# Altium schematic sheet Sheet2.SchDoc
size 420 x 297 mm; DocumentNumber: АЕСН.464431.002Э3; SheetNumber: 2; SheetTotal: x; DocumentName: Sheet1.SCHDOC
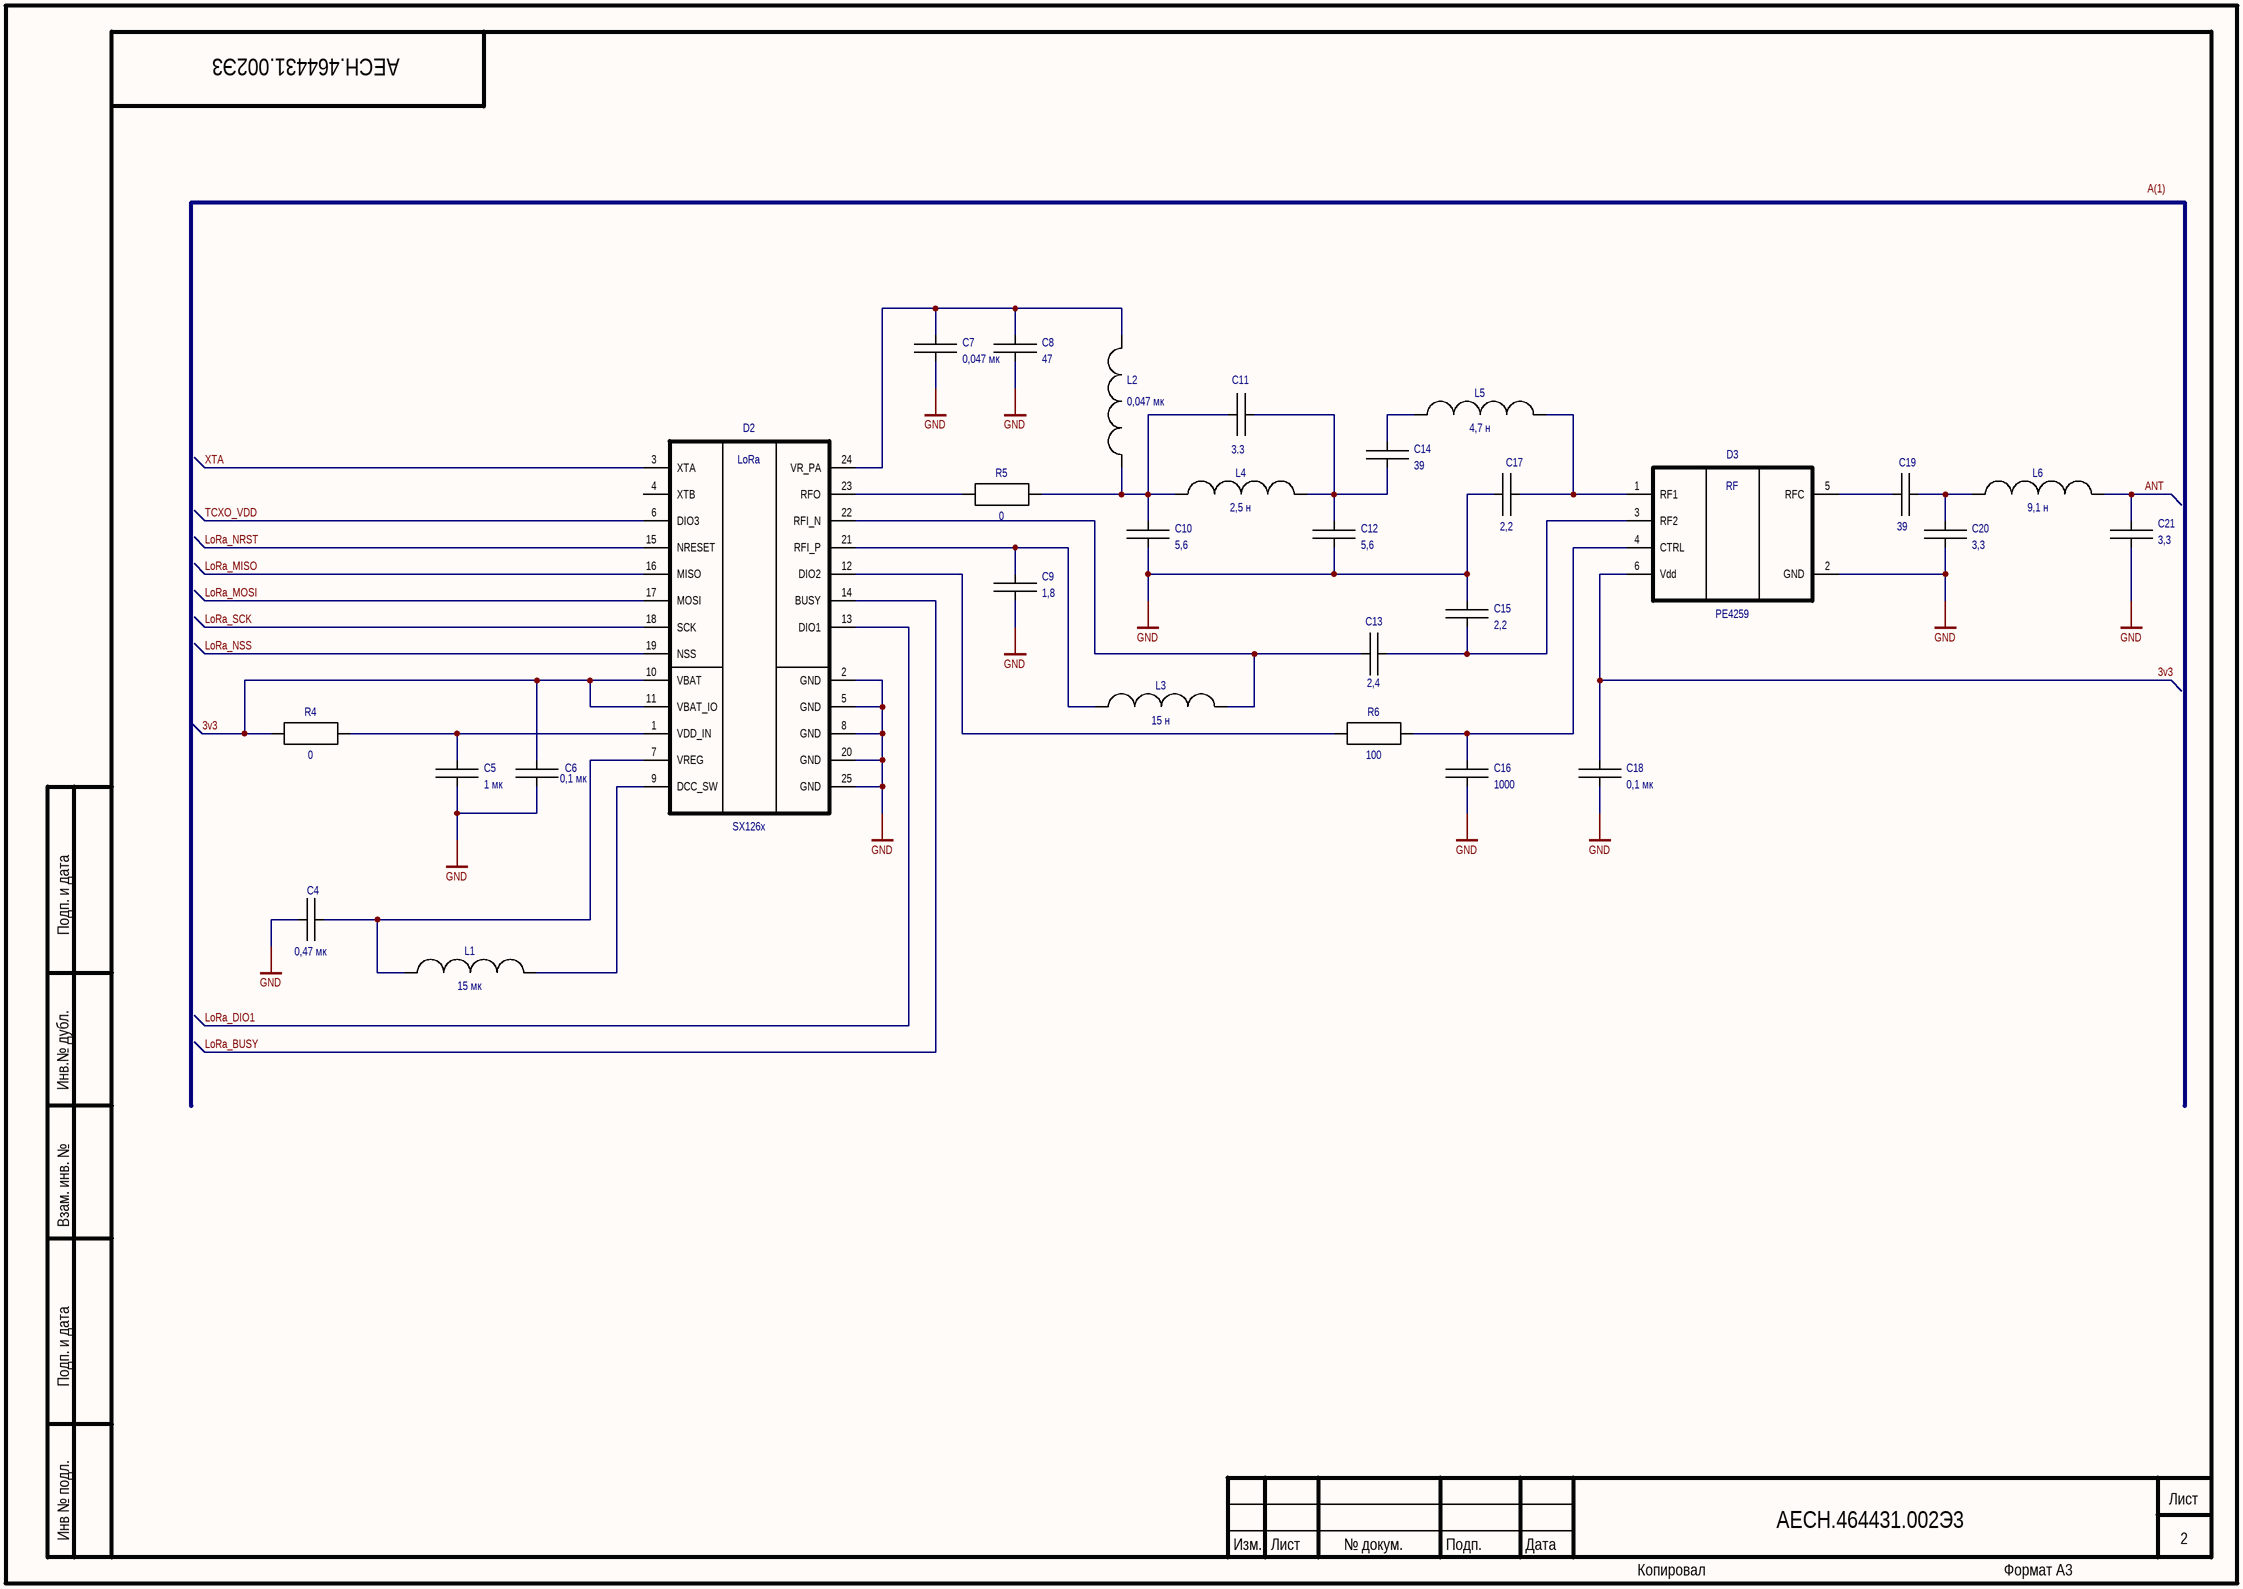
[diagram p0: Sheet2.SchDoc]

## Parts
C4  value 0,47 мк  [С0603]  (hidden comment: C)
C5  value 1 мк  [С0603]  (hidden comment: C)
C6  value 0,1 мк  [С0603]  (hidden comment: C)
C7  value 0,047 мк  [С0603]  (hidden comment: C)
C8  value 47  [С0603]  (hidden comment: C)
C9  value 1,8  [С0603]  (hidden comment: C)
C10  value 5,6  [С0603]  (hidden comment: C)
C11  value 3.3  [С0603]  (hidden comment: C)
C12  value 5,6  [С0603]  (hidden comment: C)
C13  value 2,4  [С0603]  (hidden comment: C)
C14  value 39  [С0603]  (hidden comment: C)
C15  value 2,2  [С0603]  (hidden comment: C)
C16  value 1000  [С0603]  (hidden comment: C)
C17  value 2,2  [С0603]  (hidden comment: C)
C18  value 0,1 мк  [С0603]  (hidden comment: C)
C19  value 39  [С0603]  (hidden comment: C)
C20  value 3,3  [С0603]  (hidden comment: C)
C21  value 3,3  [С0603]  (hidden comment: C)
D2  SX126x  [QFN24_4X4_SEM]
D3  PE4259  [SC70-6]
L1  value 15 мк  [IND_0805]  (hidden comment: L)
L2  value 0,047 мк  [INDC_0603]  (hidden comment: L)
L3  value 15 н  [INDC_0603]  (hidden comment: L)
L4  value 2,5 н  [INDC_0603]  (hidden comment: L)
L5  value 4,7 н  [INDC_0603]  (hidden comment: L)
L6  value 9,1 н  [INDC_0603]  (hidden comment: L)
R4  value 0  [R0603]  (hidden comment: R)
R5  value 0  [R0603]  (hidden comment: R)
R6  value 100  [R0603]  (hidden comment: R)

## Nets
GND: C4.1 C5.2 C6.2 C7.2 C8.2 C9.2 C10.2 C12.2 C15.1 C16.2 C17.1 C18.2 C20.2 C21.2 D2.2(GND) D2.5(GND) D2.8(GND) D2.20(GND) D2.25(GND) D3.2(GND)
3v3: C6.1 C18.1 D2.10(VBAT) D2.11(VBAT_IO) D3.6(Vdd) R4.1
ANT: C21.1 L6.2
LoRa_BUSY: D2.14(BUSY)
LoRa_DIO1: D2.13(DIO1)
LoRa_MISO: D2.16(MISO)
LoRa_MOSI: D2.17(MOSI)
LoRa_NRST: D2.15(NRESET)
LoRa_NSS: D2.19(NSS)
LoRa_SCK: D2.18(SCK)
TCXO_VDD: D2.6(DIO3)
XTA: D2.3(XTA)
NetC4_2: C4.2 D2.7(VREG) L1.1
NetC5_1: C5.1 D2.1(VDD_IN) R4.2
NetC7_1: C7.1 C8.1 D2.24(VR_PA) L2.2
NetC9_1: C9.1 D2.21(RFI_P) L3.1
NetC10_1: C10.1 C11.1 L2.1 L4.1 R5.2
NetC11_2: C11.2 C12.1 C14.1 L4.2
NetC13_1: C13.1 D2.22(RFI_N) L3.2
NetC13_2: C13.2 C15.2 D3.3(RF2)
NetC14_2: C14.2 L5.1
NetC16_1: C16.1 D3.4(CTRL) R6.2
NetC17_2: C17.2 D3.1(RF1) L5.2
NetC19_1: C19.1 D3.5(RFC)
NetC19_2: C19.2 C20.1 L6.1
NetD2_9: D2.9(DCC_SW) L1.2
NetD2_12: D2.12(DIO2) R6.1
NetD2_23: D2.23(RFO) R5.1

Not connected (* = marked no-connect by the designer): D2 4(XTB)

## Notes on the sheet
- Labels drawn without touching a wire or pin: A(1)
- Подп. и дата
- Инв.№ дубл.
- Взам. инв. №
- Инв № подл.
- Изм.
- Лист
- № докум.
- Подп.
- Дата
- Копировал
- Формат А3
- (in symbol PE4259) RF
- (in symbol SX126x) LoRa

## Library data of the parts
C4 C5 C16 = C: Voltage: 10 В
C6 C7 C18 = C: Voltage: 16 В
C8-C11 C13-C15 C17 C19-C21 = C: Voltage: 50 В
C12 = C: Voltage: 50